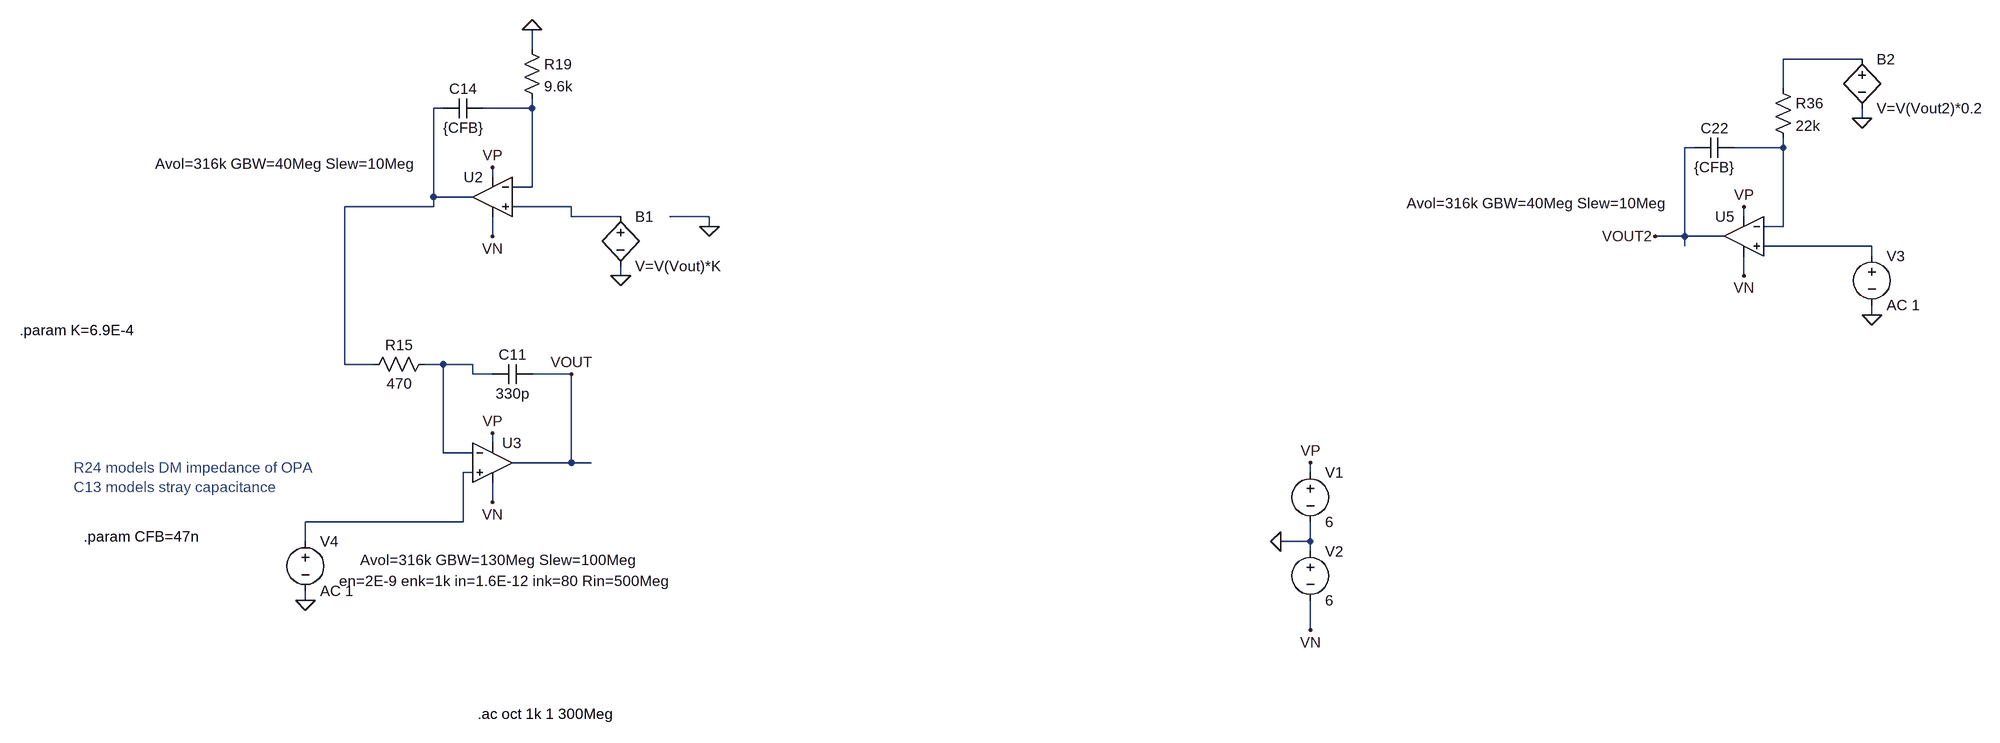
[diagram p0: schematic servo_hp.asc]
servo_hp.asc, the LTspice schematic file:
Version 4
SHEET 1 3576 1112
WIRE 1200 -2560 1200 -2592
WIRE 3360 -2544 3232 -2544
WIRE 3232 -2496 3232 -2544
WIRE 1056 -2464 1040 -2464
WIRE 1200 -2464 1200 -2480
WIRE 1200 -2464 1120 -2464
WIRE 3360 -2448 3360 -2464
WIRE 3088 -2400 3072 -2400
WIRE 3232 -2400 3232 -2416
WIRE 3232 -2400 3152 -2400
WIRE 1136 -2352 1136 -2368
WIRE 1200 -2336 1200 -2464
WIRE 1200 -2336 1168 -2336
WIRE 1040 -2320 1040 -2464
WIRE 1104 -2320 1040 -2320
WIRE 1040 -2304 1040 -2320
WIRE 1040 -2304 896 -2304
WIRE 1264 -2304 1168 -2304
WIRE 1264 -2288 1264 -2304
WIRE 1344 -2288 1264 -2288
WIRE 1488 -2288 1424 -2288
WIRE 3168 -2288 3168 -2304
WIRE 1488 -2272 1488 -2288
WIRE 3232 -2272 3232 -2400
WIRE 3232 -2272 3200 -2272
WIRE 1136 -2256 1136 -2288
WIRE 3072 -2256 3072 -2400
WIRE 3072 -2256 3024 -2256
WIRE 3136 -2256 3072 -2256
WIRE 3072 -2240 3072 -2256
WIRE 3376 -2240 3200 -2240
WIRE 3376 -2224 3376 -2240
WIRE 1344 -2192 1344 -2208
WIRE 3168 -2192 3168 -2224
WIRE 3376 -2128 3376 -2144
WIRE 896 -2048 896 -2304
WIRE 944 -2048 896 -2048
WIRE 1056 -2048 1024 -2048
WIRE 1104 -2048 1056 -2048
WIRE 1104 -2032 1104 -2048
WIRE 1136 -2032 1104 -2032
WIRE 1264 -2032 1200 -2032
WIRE 1136 -1920 1136 -1936
WIRE 1056 -1904 1056 -2048
WIRE 1104 -1904 1056 -1904
WIRE 1264 -1888 1264 -2032
WIRE 1264 -1888 1168 -1888
WIRE 1296 -1888 1264 -1888
WIRE 1104 -1872 1088 -1872
WIRE 2464 -1872 2464 -1888
WIRE 1136 -1824 1136 -1856
WIRE 1088 -1792 1088 -1872
WIRE 1088 -1792 832 -1792
WIRE 832 -1760 832 -1792
WIRE 2464 -1760 2464 -1792
WIRE 2464 -1760 2416 -1760
WIRE 2464 -1744 2464 -1760
WIRE 832 -1664 832 -1680
WIRE 2464 -1616 2464 -1664
FLAG 2416 -1760 0
FLAG 2464 -1888 VP
FLAG 2464 -1616 VN
FLAG 1136 -1936 VP
FLAG 1136 -1824 VN
FLAG 1136 -2368 VP
FLAG 1136 -2256 VN
FLAG 1488 -2272 0
FLAG 1200 -2592 0
FLAG 3168 -2304 VP
FLAG 3168 -2192 VN
FLAG 3376 -2128 0
FLAG 832 -1664 0
FLAG 1264 -2032 VOUT
FLAG 1344 -2192 0
FLAG 3360 -2448 0
FLAG 3024 -2256 VOUT2
SYMBOL voltage 2464 -1888 R0
WINDOW 123 0 0 Left 0
WINDOW 39 0 0 Left 0
SYMATTR InstName V1
SYMATTR Value 6
SYMBOL voltage 2464 -1760 R0
WINDOW 123 0 0 Left 0
WINDOW 39 0 0 Left 0
SYMATTR InstName V2
SYMATTR Value 6
SYMBOL res 928 -2032 R270
WINDOW 0 32 56 VTop 2
WINDOW 3 0 56 VBottom 2
SYMATTR InstName R15
SYMATTR Value 470
SYMBOL cap 1200 -2048 R90
WINDOW 0 0 32 VBottom 2
WINDOW 3 32 32 VTop 2
SYMATTR InstName C11
SYMATTR Value 330p
SYMBOL res 1184 -2576 R0
SYMATTR InstName R19
SYMATTR Value 9.6k
SYMBOL cap 1120 -2480 R90
WINDOW 0 0 32 VBottom 2
WINDOW 3 32 32 VTop 2
SYMATTR InstName C14
SYMATTR Value {CFB}
SYMBOL OpAmps\\UniversalOpamp2 1136 -2320 M0
WINDOW 123 135 -54 Left 2
SYMATTR Value2 Avol=316k GBW=40Meg Slew=10Meg
SYMATTR InstName U2
SYMATTR SpiceLine2 en=1E-9 enk=25 in=0.04E-12 ink=2k Rin=500Meg
SYMBOL OpAmps\\UniversalOpamp2 1136 -1888 R0
WINDOW 123 -215 158 Left 2
WINDOW 40 -249 192 Left 2
SYMATTR Value2 Avol=316k GBW=130Meg Slew=100Meg
SYMATTR SpiceLine2 en=2E-9 enk=1k in=1.6E-12 ink=80 Rin=500Meg
SYMATTR InstName U3
SYMATTR SpiceLine ilimit=80m rail=0 Vos=0 phimargin=45
SYMBOL res 3216 -2512 R0
SYMATTR InstName R36
SYMATTR Value 22k
SYMBOL cap 3152 -2416 R90
WINDOW 0 0 32 VBottom 2
WINDOW 3 32 32 VTop 2
SYMATTR InstName C22
SYMATTR Value {CFB}
SYMBOL OpAmps\\UniversalOpamp2 3168 -2256 M0
WINDOW 123 135 -54 Left 2
SYMATTR Value2 Avol=316k GBW=40Meg Slew=10Meg
SYMATTR InstName U5
SYMATTR SpiceLine2 en=1E-9 enk=25 in=0.04E-12 ink=2k Rin=500Meg
SYMBOL voltage 3376 -2240 R0
WINDOW 123 0 0 Left 0
WINDOW 39 0 0 Left 0
SYMATTR InstName V3
SYMATTR Value AC 1
SYMBOL voltage 832 -1776 R0
WINDOW 123 0 0 Left 0
WINDOW 39 0 0 Left 0
SYMATTR InstName V4
SYMATTR Value AC 1
SYMBOL bv 1344 -2304 R0
SYMATTR InstName B1
SYMATTR Value V=V(Vout)*K
SYMBOL bv 3360 -2560 R0
SYMATTR InstName B2
SYMATTR Value V=V(Vout2)*0.2
TEXT 1112 -1480 Left 2 !.ac oct 1k 1 300Meg
TEXT 456 -1880 Left 2 ;R24 models DM impedance of OPA\nC13 models stray capacitance
TEXT 368 -2104 Left 2 !.param K=6.9E-4
TEXT 472 -1768 Left 2 !.param CFB=47n

The netlist it stands for:
* servo_hp.asc
V1 VP 0 6
V2 0 VN 6
R15 N002 N007 470
C11 VOUT N007 330p
R19 0 N003 9.6k
C14 N003 N002 {CFB}
XU2 N005 N003 VP VN N002 level.2 Avol=316k GBW=40Meg Slew=10Meg ilimit=25m rail=0 Vos=0 phimargin=45 en=1E-9 enk=25 in=0.04E-12 ink=2k Rin=500Meg  ; pins IN+ IN- V+ V- OUT
XU3 N008 N007 VP VN VOUT level.2 Avol=316k GBW=130Meg Slew=100Meg ilimit=80m rail=0 Vos=0 phimargin=45 en=2E-9 enk=1k in=1.6E-12 ink=80 Rin=500Meg  ; pins IN+ IN- V+ V- OUT
R36 N001 N004 22k
C22 N004 VOUT2 {CFB}
XU5 N006 N004 VP VN VOUT2 level.2 Avol=316k GBW=40Meg Slew=10Meg ilimit=25m rail=0 Vos=0 phimargin=45 en=1E-9 enk=25 in=0.04E-12 ink=2k Rin=500Meg  ; pins IN+ IN- V+ V- OUT
V3 N006 0 AC 1
V4 N008 0 AC 1
B1 N005 0 V=V(Vout)*K
B2 N001 0 V=V(Vout2)*0.2
.ac oct 1k 1 300Meg
* R24 models DM impedance of OPA
* C13 models stray capacitance
.param K=6.9E-4
.param CFB=47n
.lib UniversalOpamps2.sub
.backanno
.end